# EAGLE design shield (EAGLE 6.5.0)
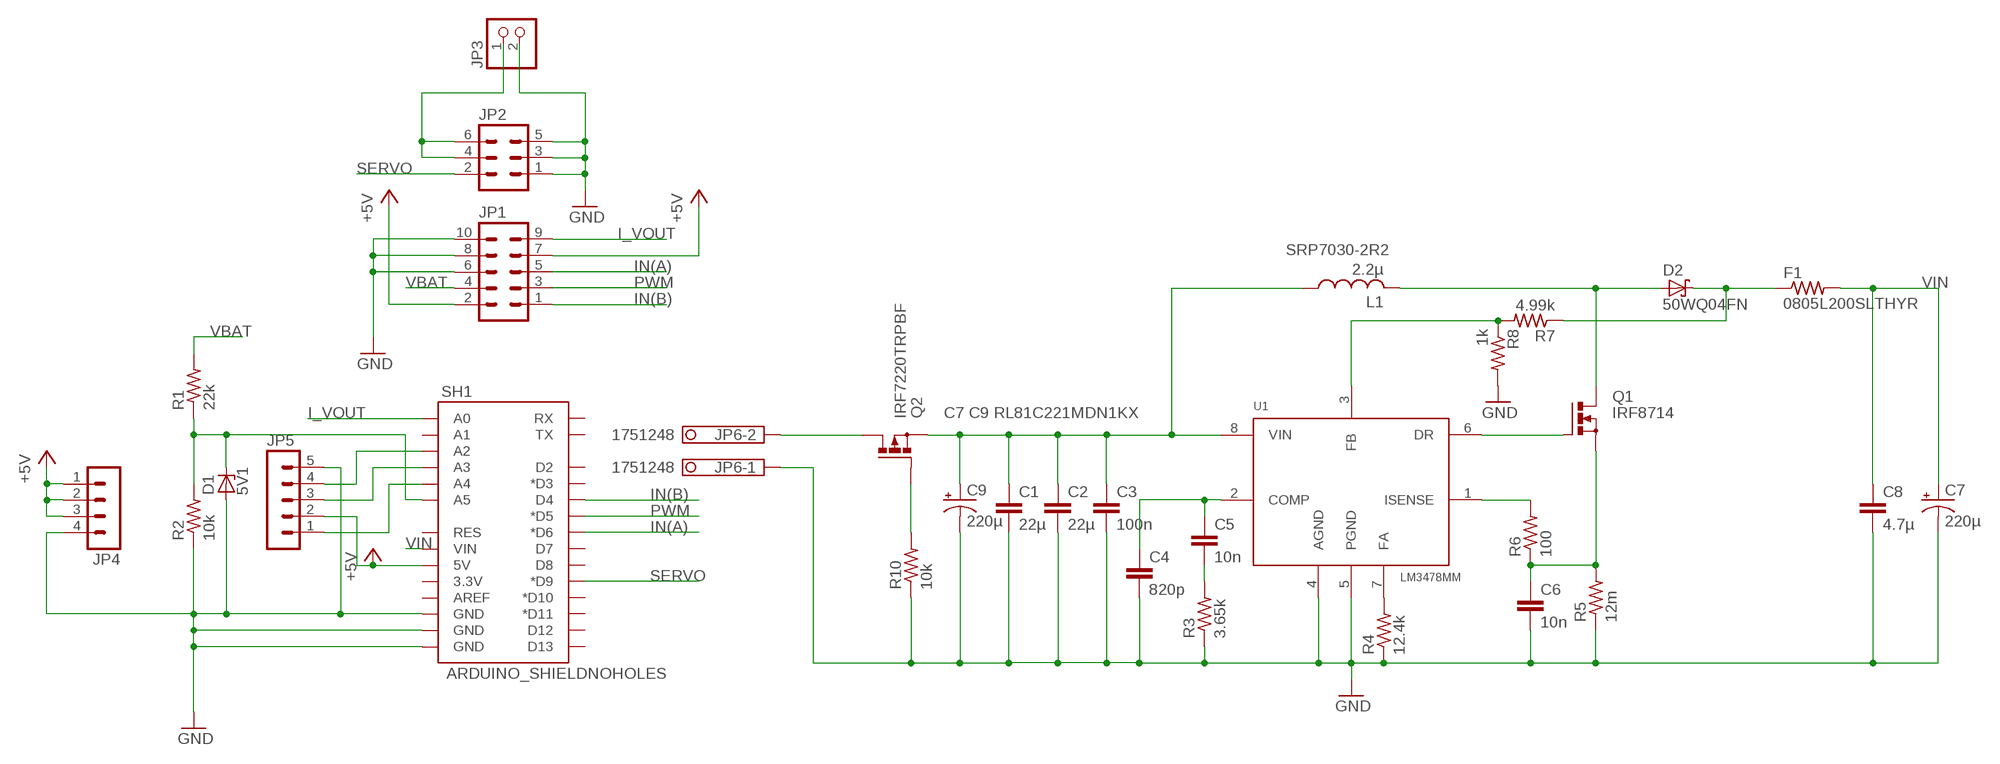
[diagram p0: schematic, sheet 1]

## Parts
C1  22µ  C-EUC3225  [C3225]
C2  22µ  C-EUC3225  [C3225]
C3  100n  C-EUC0805  [C0805]
C4  820p  C-EUC0805  [C0805]
C5  10n  C-EUC0805  [C0805]
C6  10n  C-EUC0805  [C0805]
C7  220µ  CPOL-USE3.5-8  [E3,5-8]
C8  4.7µ  C-EUC3225  [C3225]
C9  220µ  CPOL-USE3.5-8  [E3,5-8]
D1  5V1  ZENER-DIODESOT23  [SOT23]
D2  50WQ04FN  MBRD360T4G  [DPACK_1]
F1  0805L200SLTHYR  R-US_R0805  [R0805]
JP1  ML10  [ML10]
JP2  ML6  [ML6]
JP3  PINHD-1X2  [1X02]
JP4  MA04-1  [MA04-1]
JP5  MA05-1  [MA05-1]
JP6  1751248  [1751248]
L1  2.2µ  L-USSRP7030  [SRP7030]
Q1  IRF8714  N-MOSFET-SO8S  [SO-08]
Q2  IRF7220TRPBF  P-MOSFET-SO8  [SO-08]
R1  22k  R-US_R0805  [R0805]
R2  10k  R-US_R0805  [R0805]
R3  3.65k  R-US_R0805  [R0805]
R4  12.4k  R-US_R0805  [R0805]
R5  12m  R-US_R1206  [R1206]
R6  100  R-US_R0805  [R0805]
R7  4.99k  R-US_R0805  [R0805]
R8  1k  R-US_R0805  [R0805]
R10  10k  R-US_R0805  [R0805]
SH1  ARDUINO_SHIELDNOHOLES  [DUEMILANOVE_SHIELD_NOHOLES]
U1  LM3478MM  [DGK_S-PDSO-G8]

## Nets
+5V: JP1.2 JP1.7 JP4.1 JP4.2 JP4.3 JP5.2 SH1.5V
GND: C1.2 C2.2 C3.2 C4.2 C6.2 C7.- C8.2 C9.- D1.1(A) JP1.6 JP1.8 JP1.10 JP2.1 JP2.3 JP2.5 JP3.2 JP4.4 JP5.5 JP6.1 R2.1 R3.1 R4.1 R5.1 R8.2 R10.1 SH1.GND@0(GND) SH1.GND@1(GND) SH1.GND@2(GND) U1.4(AGND) U1.5(PGND)
I_VOUT: JP1.9 SH1.A0
IN(A): JP1.5 SH1.D6(*D6)
IN(B): JP1.1 SH1.D4
N$1: D1.3(C) R1.1 R2.2 SH1.A5
N$2: JP2.4 JP2.6 JP3.1
N$3: D2.K(C) F1.1 R7.1
N$4: JP6.2 Q2.5(D) Q2.6(D) Q2.7(D) Q2.8(D)
N$5: Q2.4(G) R10.2
N$6: JP5.4 SH1.A2
N$7: JP5.3 SH1.A3
N$8: JP5.1 SH1.A4
N$9: R4.2 U1.7(FA)
N$10: C5.2 R3.2
N$11: C4.1 C5.1 U1.2(COMP)
N$12: C1.1 C2.1 C3.1 C9.+ L1.1 Q2.1(S) Q2.2(S) Q2.3(S) U1.8(VIN)
N$13: Q1.4(G) U1.6(DR)
N$14: C6.1 Q1.1(S) Q1.2(S) Q1.3(S) R5.2 R6.1
N$16: R6.2 U1.1(ISENSE)
N$17: D2.A1(A) D2.A2(A) L1.2 Q1.5(D) Q1.6(D) Q1.7(D) Q1.8(D)
N$18: R7.2 R8.1 U1.3(FB)
PWM: JP1.3 SH1.D5(*D5)
SERVO: JP2.2 SH1.D9(*D9)
VBAT: JP1.4 R1.2
VIN: C7.+ C8.1 F1.2 SH1.VIN
Unconnected: SH1.3.3V SH1.A1 SH1.AREF SH1.D2 SH1.D3(*D3) SH1.D7 SH1.D8 SH1.D10(*D10) SH1.D11(*D11) SH1.D12 SH1.D13 SH1.RES SH1.RX SH1.TX

## Notes on the sheet
- SRP7030-2R2
- C7 C9 RL81C221MDN1KX

## Library data of the parts
C1-C6 C8 = rcl:C-EU: CAPACITOR, European symbol
C7 C9 = rcl:CPOL-US: POLARIZED CAPACITOR, American symbol
D1 = diode:ZENER-DIODE: Z-Diode
D2 = diode:MBRD360T4G
F1 R1-R8 R10 = rcl:R-US_: RESISTOR, American symbol
JP1 = con-ml:ML10: HARTING; OC_FARNELL: unknown; OC_NEWARK: unknown
JP2 = con-harting-ml:ML6: HARTING; OC_FARNELL: unknown; OC_NEWARK: unknown
JP3 = pinhead:PINHD-1X2: PIN HEADER
JP4 = con-lstb:MA04-1: PIN HEADER; OC_FARNELL: unknown; OC_NEWARK: unknown
JP5 = con-lstb:MA05-1: PIN HEADER; OC_FARNELL: unknown; OC_NEWARK: unknown
JP6 = con-phoenix-350:1751248: MKDS 1/ 2-3,5 Printklemme Nennstrom: 10 A Bemessungsspannung: 160 V Raster: 3,5 mm Polzahl: 2 Montageart: Löten Anschlussart: Schraubanschluss Anschlussrichtung vom Leiter zur Platine: 0° Source: http://eshop.phoenixcontact.com .. 1751248.pdf; OC_FARNELL: unknown; OC_NEWARK: unknown
L1 = inductors:L-US: INDUCTOR, American symbol
Q1 = transistor-power:N-MOSFET-SO8: N-Channel MOSFET Example: FDS7760A; N-Channel Logic Level PowerTrench® MOSFET FDS2572; N-Channel UltraFET® Trench MOSFET Source: www.fairchildsemi.com
Q2 = transistor-power:P-MOSFET-SO8: P-Channel MOSFET Example: FDS4435A; P-Channel Logic Level PowerTrench® MOSFET FDS4465; P-Channel 1.8V Specified PowerTrench® MOSFET Source: www.fairchildsemi.com
SH1 = SparkFun-Boards:ARDUINO_SHIELD: Arduino shield footprint
U1 = LM3478:LM3478

## Board
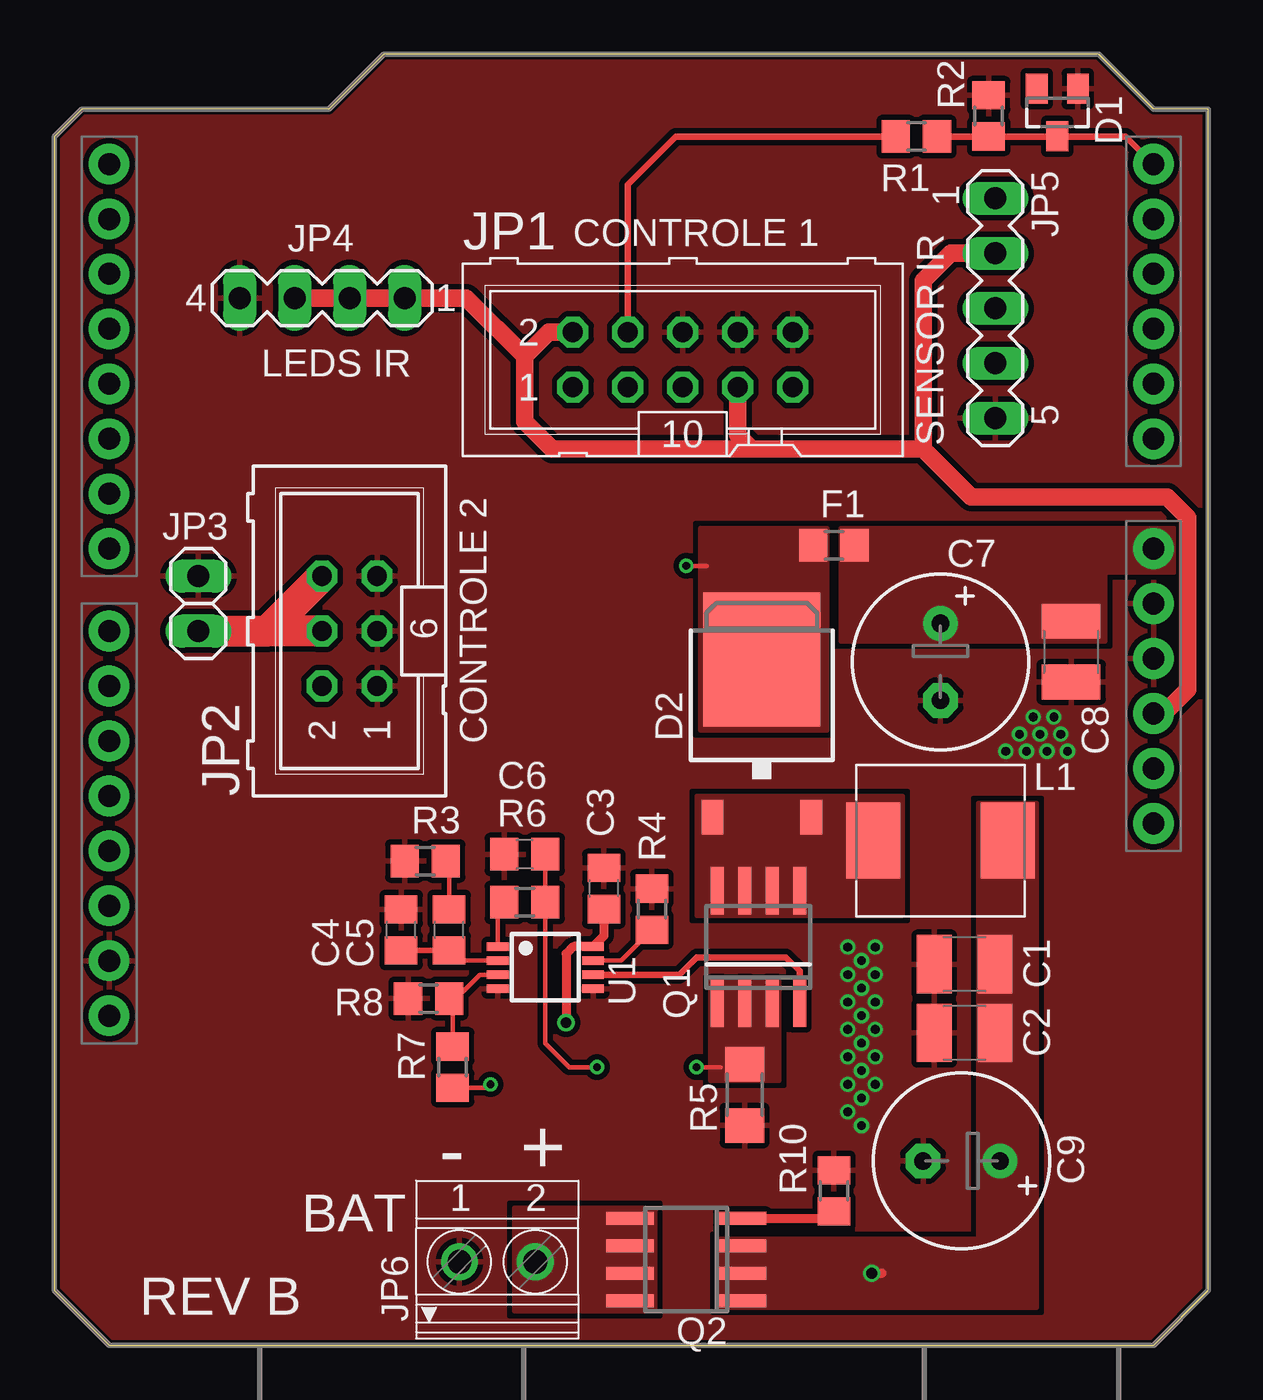
[diagram p1: board, top side]
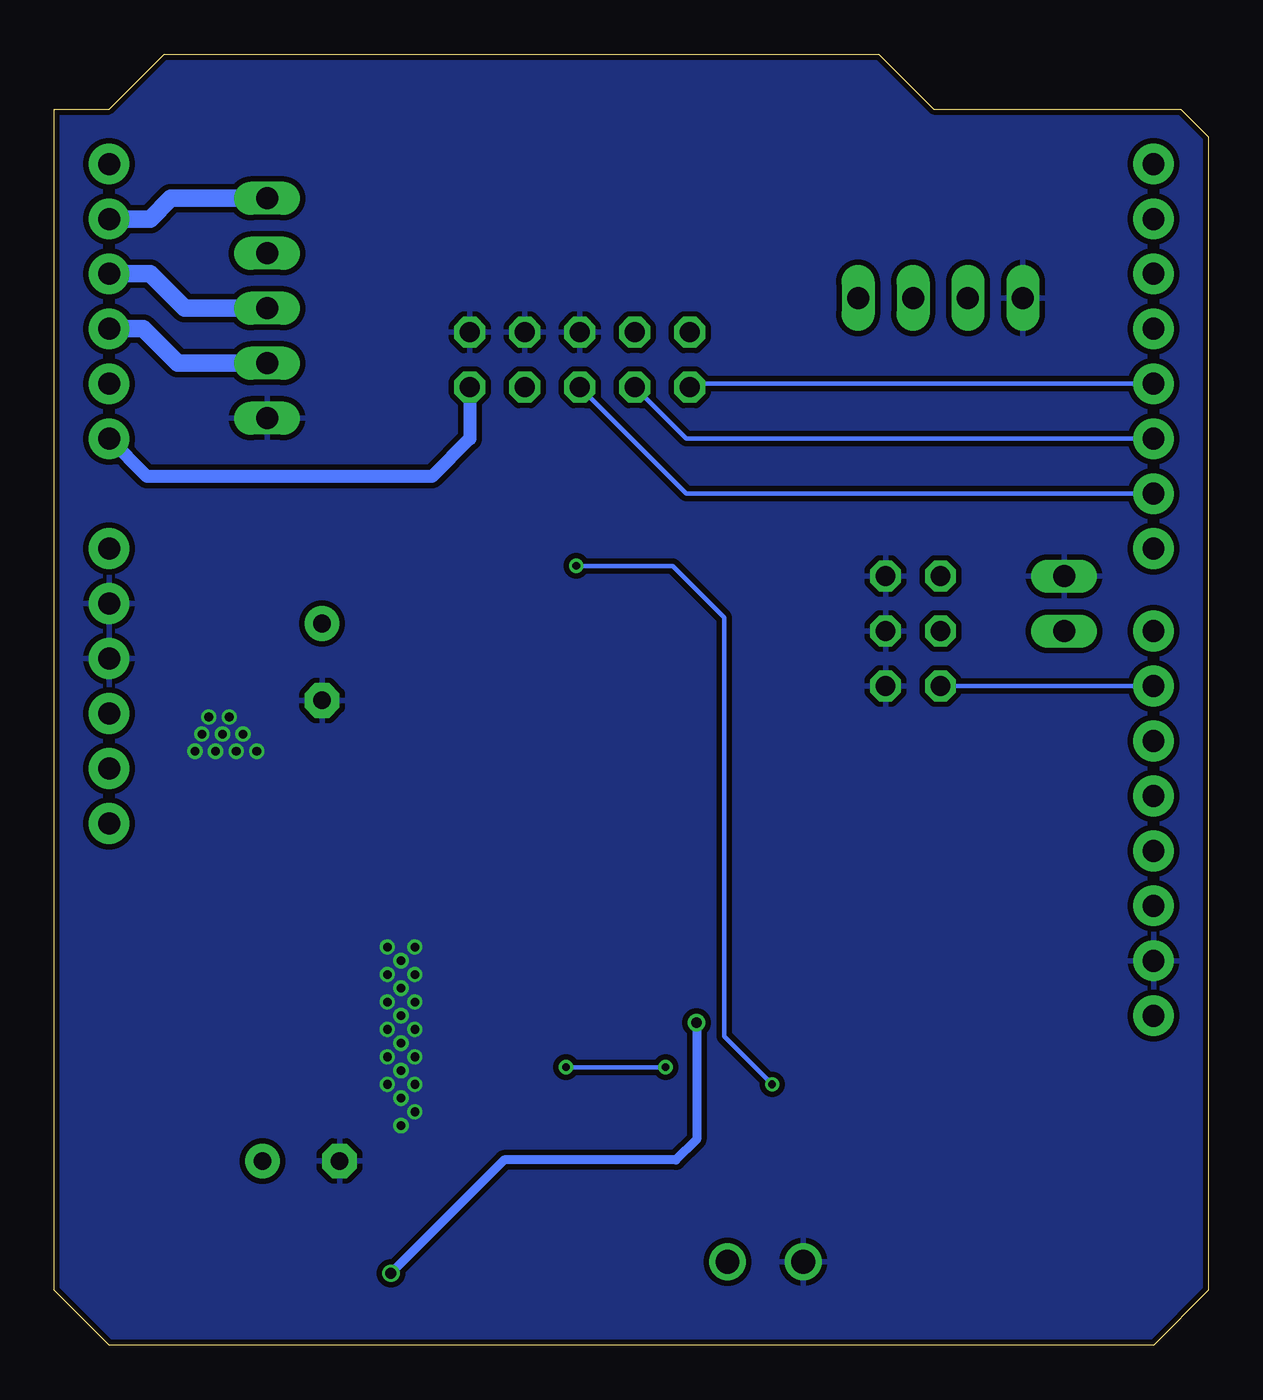
[diagram p2: board, bottom side, seen from below]

Size 53.34 x 59.69 mm. Coordinates in mm from the lower left corner, seen from the top.
Outline: 0,2.54 2.54,0 50.8,0 53.34,2.54 53.34,57.15 50.8,57.15 48.26,59.69 15.24,59.69 12.7,57.15 1.27,57.15 0,55.88 0,2.54
Copper layers (1*16): Top 0.035mm / dielectric 1.5mm / Bottom 0.035mm
Design rules "ITEADstudio_DRC": minimum track width 6mil, minimum drill 12mil, track to track 6mil, track to pad 6mil, pad to pad 6mil, via to via 6mil, smd to smd 0mil, copper to edge 10mil, drill to drill 10mil, minimum pad ring 10mil, minimum via ring 6mil, stop-mask expansion 2mil, vias tented up to drill 100mil, thermal gap 10mil

### Footprints (pad centres in the part's own frame; a part is rotated, then mirrored left to right if it is on the bottom)
C3225 = smd 1.6 x 2.7: 1 -1.4,0; 2 1.4,0
C0805 = smd 1.3 x 1.5: 1 -0.95,0; 2 0.95,0
E3,5-8 = drill 0.813 pad 1.6: + -1.778,0 | drill 0.813 pad 1.6 octagon: - 1.778,0
SOT23 = smd 1 x 1.4: 1 -0.95,-1.1; 2 0.95,-1.1; 3 0,1.1
DPACK_1 = smd 1 x 1.6: A1 -2.28,-4.8; A2 2.28,-4.8 | smd 5.4 x 6.2: K 0,2.5
R0805 = smd 1.3 x 1.5: 1 -0.95,0; 2 0.95,0
ML10 = drill 0.914 octagon: 1 -5.08,-1.27; 2 -5.08,1.27; 3 -2.54,-1.27; 4 -2.54,1.27; 5 0,-1.27; 6 0,1.27; 7 2.54,-1.27; 8 2.54,1.27; 9 5.08,-1.27; 10 5.08,1.27
ML6 = drill 0.914 octagon: 1 -2.54,-1.27; 2 -2.54,1.27; 3 0,-1.27; 4 0,1.27; 5 2.54,-1.27; 6 2.54,1.27
1X02 = drill 1.016 long: 1 -1.27,0; 2 1.27,0
MA04-1 = drill 1.016 long: 1 -3.81,0; 2 -1.27,0; 3 1.27,0; 4 3.81,0
MA05-1 = drill 1.016 long: 1 -5.08,0; 2 -2.54,0; 3 0,0; 4 2.54,0; 5 5.08,0
1751248 = drill 1.1 pad 1.7: 1 -1.75,-0.1; 2 1.75,-0.1
SRP7030 = smd 2.5 x 3.5: 1 -3.1,0; 2 3.1,0
SO-08 = smd 0.6 x 2.2: 1 -1.905,-2.6; 2 -0.635,-2.6; 3 0.635,-2.6; 4 1.905,-2.6; 5 1.905,2.6; 6 0.635,2.6; 7 -0.635,2.6; 8 -1.905,2.6
R1206 = smd 1.6 x 1.803: 1 -1.422,0; 2 1.422,0
DUEMILANOVE_SHIELD_NOHOLES = drill 1.016 pad 1.88: 3.3V 50.8,26.67; 5V 50.8,29.21; A0 50.8,41.91; A1 50.8,44.45; A2 50.8,46.99; A3 50.8,49.53; A4 50.8,52.07; A5 50.8,54.61; AREF 2.54,15.24; D2 2.54,49.53; D3 2.54,46.99; D4 2.54,44.45; D5 2.54,41.91; D6 2.54,39.37; D7 2.54,36.83; D8 2.54,33.02; D9 2.54,30.48; D10 2.54,27.94; D11 2.54,25.4; D12 2.54,22.86; D13 2.54,20.32; GND@0 50.8,31.75; GND@1 50.8,34.29; GND@2 2.54,17.78; RES 50.8,24.13; RX 2.54,54.61; TX 2.54,52.07; VIN 50.8,36.83
DGK_S-PDSO-G8 = smd 0.4 x 1: 1 -0.975,-2.2; 2 -0.325,-2.2; 3 0.325,-2.2; 4 0.975,-2.2; 5 0.975,2.2; 6 0.325,2.2; 7 -0.325,2.2; 8 -0.975,2.2

### Placement (x,y rotation side)
C1  42.07,17.62 180 top
C2  42.07,14.45 180 top
C3  25.4,21.11 90 top
C4  16.03,19.21 90 top
C5  18.26,19.21 90 top
C6  21.75,22.7 180 top
C7  40.96,31.59 270 top
C8  46.99,32.07 270 top
C9  41.93,8.53 180 top
D1  46.35,56.99 180 top
D2  32.7,29.21 0 top
F1  36.04,36.99 0 top
JP1  29.05,45.56 0 top
JP2  13.65,33.02 90 top
JP3  6.67,34.29 90 top
JP4  12.38,48.42 180 top
JP5  43.5,47.94 270 top
JP6  20.48,3.97 0 top
L1  40.96,23.34 180 top
Q1  32.54,18.41 0 top
Q2  29.21,3.97 90 top
R1  39.85,55.88 180 top
R2  43.18,56.83 270 top
R3  17.14,22.38 0 top
R4  27.62,20.16 270 top
R5  31.91,11.59 90 top
R6  21.75,20.48 180 top
R7  18.41,12.86 90 top
R8  17.3,16.03 180 top
R10  36.04,7.14 270 top
SH1  0,0 0 top
U1  22.7,17.46 270 top

### Tracks (layer width: path | path; a pad name or v marks a point on that pad's centre or on a via)
+5V
  Top 0.813: JP1.2 22.86,46.83 21.75,45.72 | 21.75,45.72 21.75,42.7 23.02,41.43 32.23,41.43 | 32.23,41.43 40.01,41.43 | 40.01,41.43 40.16,41.43 42.39,39.21 51.44,39.21 52.39,38.26 52.39,30.32 51.28,29.21 SH1.5V | JP5.2 41.43,50.48 40.16,49.21 40.16,41.59 40.01,41.43 | JP1.7 31.59,42.07 32.23,41.43 | 21.75,45.72 19.05,48.42 JP4.1 JP4.2 JP4.3
GND  (via drill 0.4)
  other vias: 37.94,13.34 37.31,13.97 37.94,14.61 37.31,15.24 37.94,15.88 37.31,16.51 37.94,17.14 37.31,17.78 37.94,18.41 36.67,13.34 36.67,14.61 36.67,15.88 36.67,17.14 36.67,18.41 37.31,12.7 36.67,12.06 37.94,12.06 37.31,11.43 36.67,10.79 37.31,10.16 43.97,27.46 44.61,28.26 45.24,29.05 44.93,27.46 45.56,28.26 45.88,27.46 46.2,29.05 46.51,28.26 46.83,27.46
  pour Bottom (isolate 0.254, rank 6): 0,2.54 2.54,0 50.8,0 53.34,2.54 53.34,57.15 50.8,57.15 48.26,59.69 15.24,59.69 12.7,57.15 1.27,57.15 0,55.88
  pour Top (isolate 0.254, rank 6): 0,2.54 2.54,0 50.8,0 53.34,2.54 53.34,57.15 50.8,57.15 48.26,59.69 15.24,59.69 12.7,57.15 1.27,57.15 0,55.88
I_VOUT
  Bottom 0.61: JP1.9 34.13,41.91 35.88,40.16 49.05,40.16 SH1.A0
IN(A)
  Bottom 0.203: SH1.D6 24.13,39.37 JP1.5
IN(B)
  Bottom 0.203: SH1.D4 23.81,44.45 JP1.1
N$1
  Top 0.305: R1.1 43.96,55.88 D1.3 46.82,55.89 R2.2 49.53,55.88 SH1.A5
N$2
  Top 1.422: JP3.1 9.37,33.02 9.84,33.02 | 9.84,33.02 JP2.6 | JP2.4 9.84,33.02
N$3  (via drill 0.36)
  Top 0.203: R7.1 20,11.91 v20.16,12.06 | v29.21,36.04 30.16,36.04
  Bottom 0.203: v20.16,12.06 22.38,14.29 22.38,33.66 24.77,36.04 v29.21,36.04
  pour Top (no thermals): 35.72,37.78 29.84,37.78 29.84,28.42 35.72,28.42
N$4
  pour Top (no thermals): 27.78,6.35 21.27,6.35 21.27,1.59 27.78,1.59
N$5
  Top 0.406: Q2.4 36.04,5.87 R10.2
N$6
  Bottom 0.813: JP5.4 47.62,45.4 49.21,46.99 SH1.A2
N$7
  Bottom 0.813: SH1.A3 48.9,49.53 47.31,47.94 JP5.3
N$8
  Bottom 0.813: SH1.A4 48.9,52.07 47.94,53.02 JP5.1
N$9
  Top 0.203: U1.7 26.2,17.79 R4.2
N$10
  Top 0.203: C5.2 18.26,22.22 R3.2
N$11
  Top 0.203: C5.1 18.73,17.79 U1.2
  Top 0.254: C4.1 C5.1
N$12  (via drill 0.5)
  Top 0.406: C3.1 25.4,18.94 U1.8 23.99,18.44 23.65,18.1 v23.65,14.92 | v37.78,3.33 38.26,3.33
  Bottom 0.406: v23.65,14.92 23.65,9.53 24.61,8.57 32.54,8.57 v37.78,3.33
  pour Top (no thermals): 30.64,4.92 30.64,1.75 45.4,1.75 45.4,25.08 42.7,25.08 42.7,4.92
N$13
  Top 0.305: Q1.4 34.45,17.3 33.81,17.94 29.69,17.94 28.89,17.14 U1.6
N$14  (via drill 0.36)
  Top 0.203: C6.1 R6.1 22.7,13.97 23.81,12.86 v25.08,12.86 | v29.69,12.86 30.8,12.86
  Bottom 0.203: v25.08,12.86 v29.69,12.86
  pour Top (no thermals): 30.32,16.83 33.5,16.83 33.5,12.22 30.32,12.22
N$16
  Top 0.203: U1.1 20.5,20.18 R6.2
N$17
  pour Top (no thermals): 29.69,25.4 29.69,19.84 39.21,19.84 39.21,25.4
N$18
  Top 0.203: U1.3 19.68,17.14 18.89,16.35 18.57,16.35 R8.1 18.42,15.87 R7.2
PWM
  Bottom 0.203: SH1.D5 24.13,41.91 JP1.3
SERVO
  Bottom 0.203: SH1.D9 JP2.2
VBAT
  Top 0.305: JP1.4 26.51,53.66 28.73,55.88 R1.2
VIN
  pour Top (no thermals): 36.35,37.78 36.35,32.54 48.58,32.54 48.58,35.72 51.75,35.72 51.75,37.78

### Text on the board
tPlace: CONTROLE 1 | LEDS IR | SENSOR IR | CONTROLE 2 | - | + | BAT | REV B